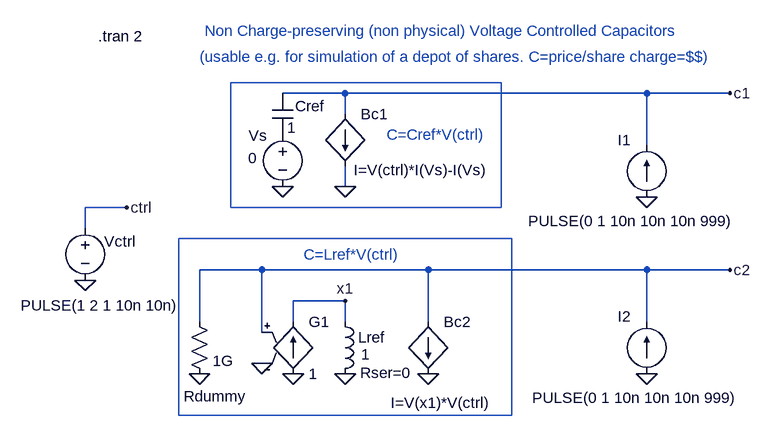
[diagram p0: schematic Controlled_Cap_non_phys.asc]
Controlled_Cap_non_phys.asc, the LTspice schematic file:
Version 4
SHEET 1 880 680
WIRE -32 -176 -128 -176
WIRE 432 -176 -32 -176
WIRE 560 -176 432 -176
WIRE -32 -144 -32 -176
WIRE 432 -96 432 -176
WIRE -32 -32 -32 -64
WIRE -368 0 -432 0
WIRE -432 32 -432 0
WIRE -160 96 -256 96
WIRE 96 96 -160 96
WIRE 432 96 96 96
WIRE 560 96 432 96
WIRE -32 144 -112 144
WIRE -256 176 -256 96
WIRE -112 176 -112 144
WIRE -32 176 -32 144
WIRE 96 176 96 96
WIRE 432 176 432 96
WIRE -160 192 -160 96
FLAG -112 256 0
FLAG -32 256 0
FLAG 96 256 0
FLAG -160 240 0
FLAG -32 144 x1
FLAG 560 96 c2
FLAG -432 112 0
FLAG -368 0 ctrl
FLAG 432 256 0
FLAG -256 256 0
FLAG -32 -32 0
FLAG -128 -32 0
FLAG 560 -176 c1
FLAG 432 -16 0
SYMBOL ind -48 160 R0
WINDOW 39 39 95 Left 0
WINDOW 3 41 66 Left 0
SYMATTR SpiceLine Rser=0
SYMATTR InstName Lref
SYMATTR Value 1
SYMBOL g -112 160 R0
SYMATTR InstName G1
SYMATTR Value 1
SYMBOL bi 96 176 R0
WINDOW 3 -58 125 Left 0
SYMATTR InstName Bc2
SYMATTR Value I=V(x1)*V(ctrl)
SYMBOL voltage -432 16 R0
WINDOW 0 29 36 Left 0
WINDOW 3 -99 135 Left 0
WINDOW 123 0 0 Left 0
WINDOW 39 0 0 Left 0
SYMATTR InstName Vctrl
SYMATTR Value PULSE(1 2 1 10n 10n)
SYMBOL current 432 256 R180
WINDOW 0 24 88 Left 0
WINDOW 3 -141 -37 Left 0
SYMATTR InstName I2
SYMATTR Value PULSE(0 1 10n 10n 10n 999)
SYMBOL res -272 160 R0
WINDOW 0 -8 131 Left 0
SYMATTR InstName Rdummy
SYMATTR Value 1G
SYMBOL bi -32 -144 R0
WINDOW 3 13 86 Left 0
SYMATTR Value I=V(ctrl)*I(Vs)-I(Vs)
SYMATTR InstName Bc1
SYMBOL cap -144 -176 R0
WINDOW 3 23 53 Left 0
WINDOW 0 35 20 Left 0
SYMATTR Value 1
SYMATTR InstName Cref
SYMBOL voltage -128 -128 R0
WINDOW 0 -52 17 Left 0
WINDOW 3 -53 52 Left 0
SYMATTR InstName Vs
SYMATTR Value 0
SYMBOL current 432 -16 R180
WINDOW 0 24 88 Left 0
WINDOW 3 -135 -37 Left 0
SYMATTR InstName I1
SYMATTR Value PULSE(0 1 10n 10n 10n 999)
TEXT -412 -264 Left 0 !.tran 2
TEXT -248 -272 Left 0 ;Non Charge-preserving (non physical) Voltage Controlled Capacitors
TEXT 32 -112 Left 0 ;C=Cref*V(ctrl)
TEXT -96 72 Left 0 ;C=Lref*V(ctrl)
TEXT -256 -232 Left 0 ;(usable e.g. for simulation of a depot of shares. C=price/share charge=$$)
RECTANGLE Normal 208 0 -208 -192
RECTANGLE Normal 224 320 -288 48

The netlist it stands for:
* Controlled_Cap_non_phys.asc
Lref x1 0 1 Rser=0
G1 0 x1 c2 0 1
Bc2 c2 0 I=V(x1)*V(ctrl)
Vctrl ctrl 0 PULSE(1 2 1 10n 10n)
I2 0 c2 PULSE(0 1 10n 10n 10n 999)
Rdummy c2 0 1G
Bc1 c1 0 I=V(ctrl)*I(Vs)-I(Vs)
Cref c1 P001 1
Vs P001 0 0
I1 0 c1 PULSE(0 1 10n 10n 10n 999)
.tran 2
* Non Charge-preserving (non physical) Voltage Controlled Capacitors
* C=Cref*V(ctrl)
* C=Lref*V(ctrl)
* (usable e.g. for simulation of a depot of shares. C=price/share charge=$$)
.backanno
.end